# EAGLE design terminal (EAGLE 6.5.0)
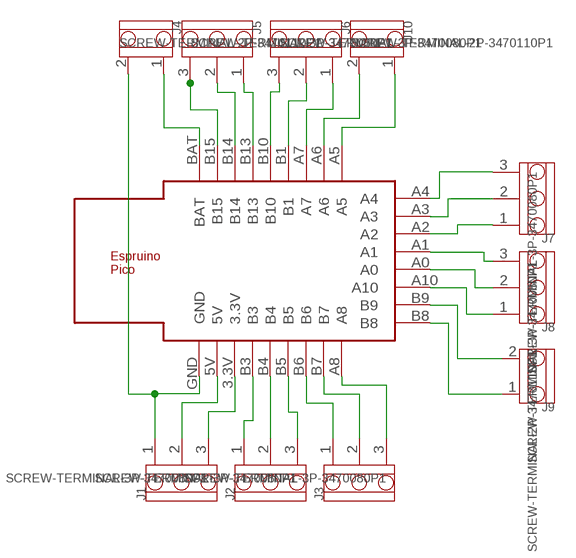
[diagram p0: schematic, sheet 1]

## Parts
J1  SCREW-TERMINAL-3P-3470080P1  [3P-5.0]
J2  SCREW-TERMINAL-3P-3470080P1  [3P-5.0]
J3  SCREW-TERMINAL-3P-3470080P1  [3P-5.0]
J4  SCREW-TERMINAL-2P-3470110P1  [2P-5.0]
J5  SCREW-TERMINAL-3P-3470080P1  [3P-5.0]
J6  SCREW-TERMINAL-3P-3470080P1  [3P-5.0]
J7  SCREW-TERMINAL-3P-3470080P1  [3P-5.0]
J8  SCREW-TERMINAL-3P-3470080P1  [3P-5.0]
J9  SCREW-TERMINAL-2P-3470110P1  [2P-5.0]
J10  SCREW-TERMINAL-2P-3470110P1  [2P-5.0]
U$1  ESPRUINO_PICO_SMD  [ESPRUINO_PICO_SMD]

## Nets
N$1: J4.1 U$1.BAT
N$2: J5.3 U$1.B15
N$3: J5.2 U$1.B14
N$4: J5.1 U$1.B13
N$5: J6.3 U$1.B10
N$6: J6.2 U$1.B1
N$7: J6.1 U$1.A7
N$8: J10.2 U$1.A6
N$9: J10.1 U$1.A5
N$10: J7.3 U$1.A4
N$11: J7.2 U$1.A3
N$12: J7.1 U$1.A2
N$13: J8.3 U$1.A1
N$14: J8.2 U$1.A0
N$15: J8.1 U$1.A10
N$16: J9.2 U$1.B9
N$17: J9.1 U$1.B8
N$18: J3.3 U$1.A8
N$19: J3.2 U$1.B7
N$20: J3.1 U$1.B6
N$21: J2.3 U$1.B5
N$22: J2.2 U$1.B4
N$23: J2.1 U$1.B3
N$24: J1.3 U$1.3.3V
N$25: J1.2 U$1.5V
N$26: J1.1 J4.2 U$1.GND

## Library data of the parts
J1-J3 J5-J8 = OPL Eagle Library:SCREW-TERMINAL-3P
J4 J9 J10 = OPL Eagle Library:SCREW-TERMINAL-2P
U$1 = espruino_pico:ESPRUINO_PICO_SMD

## Net classes
0 default: width 0.305 mm

## Board
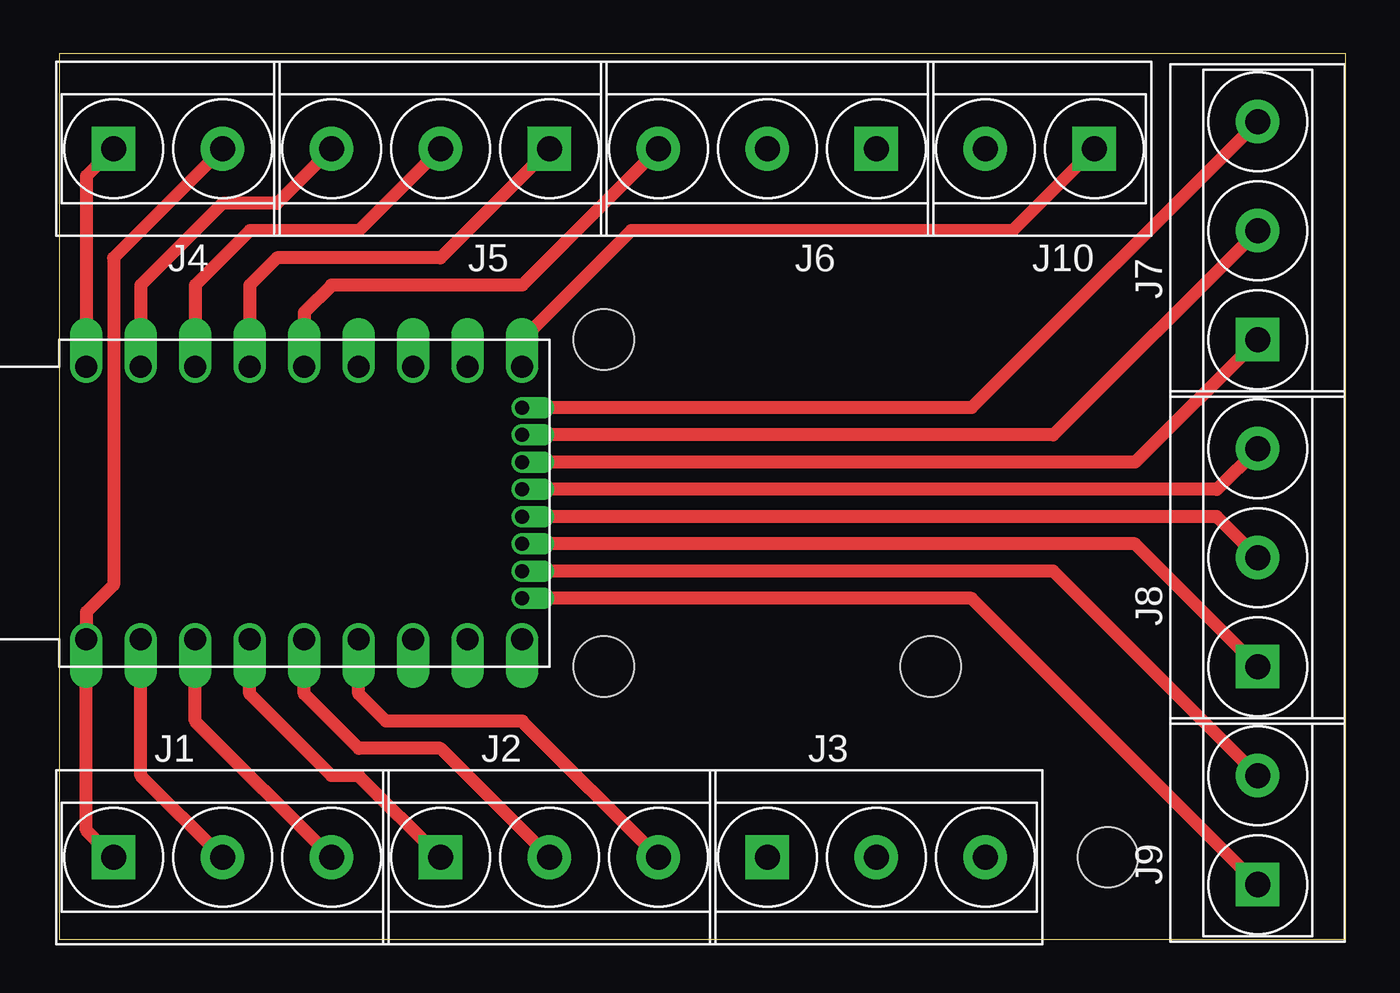
[diagram p1: board, top side]
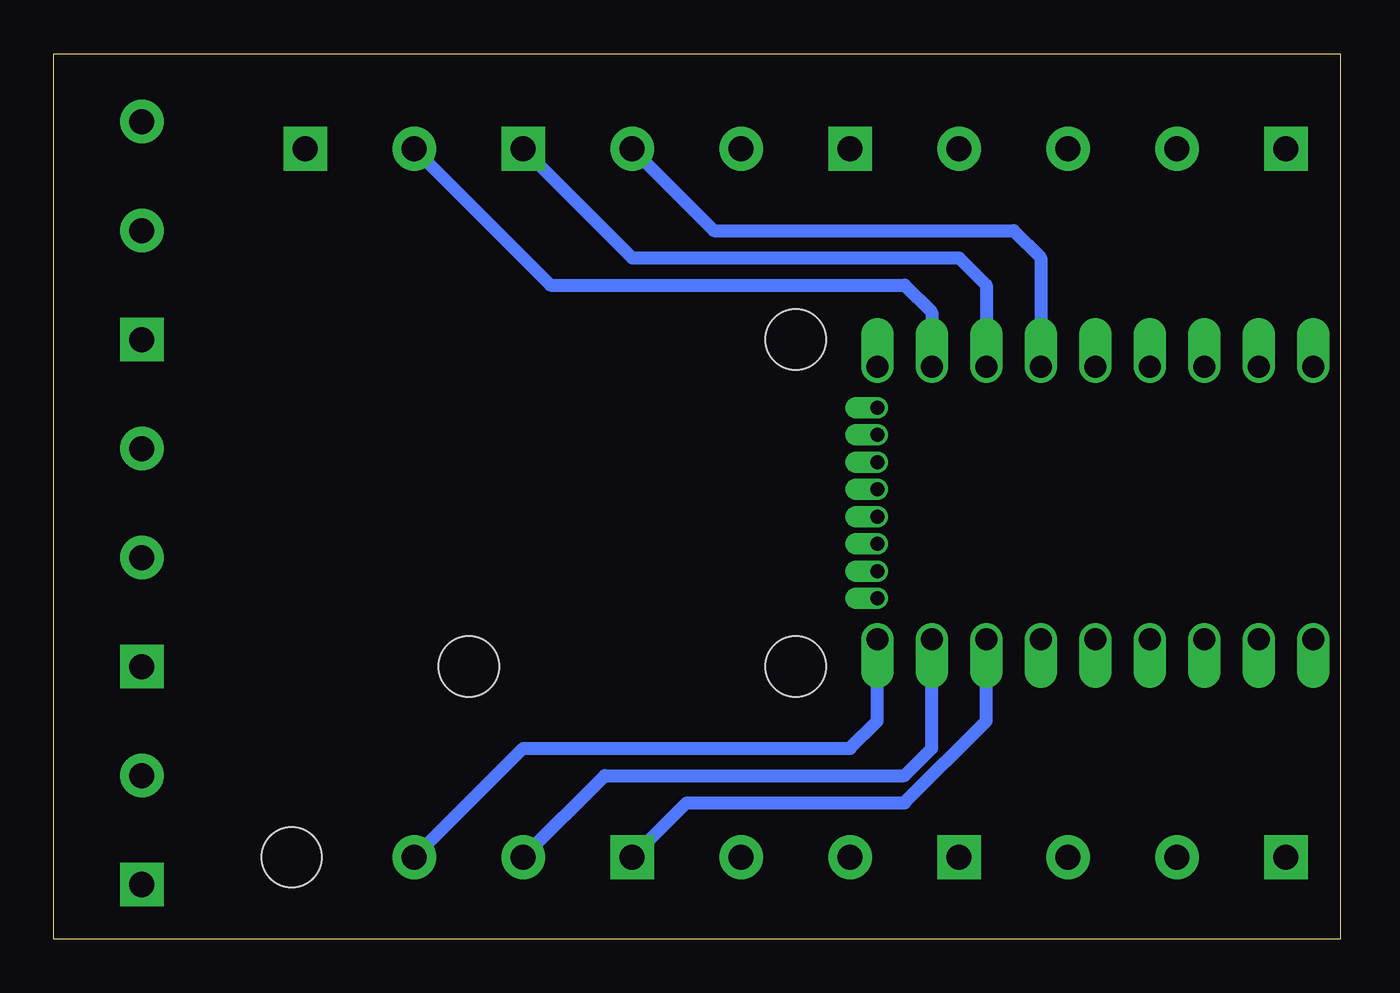
[diagram p2: board, bottom side, seen from below]

Size 59.99 x 41.27 mm. Coordinates in mm from the lower left corner, seen from the top.
Outline: 0,0 59.99,0 59.99,41.27 0,41.27 0,0
Copper layers (1*16): Top 0.0356mm / dielectric 1.5011mm / Bottom 0.0356mm
Design rules "oshpark": minimum track width 10mil, minimum drill 13mil, track to track 8mil, track to pad 6mil, pad to pad 6mil, via to via 6mil, smd to smd 6mil, copper to edge 15mil, drill to drill 6mil, minimum pad ring 7mil, minimum via ring 7mil, stop-mask expansion 4mil, vias tented up to drill 15mil, thermal gap 10mil
Holes 2.8 mm at 48.9,3.81 40.64,12.7 25.4,27.94 25.4,12.7

### Footprints (pad centres in the part's own frame; a part is rotated, then mirrored left to right if it is on the bottom)
3P-5.0 = drill 1.168 pad 2.032 square: 1 -5.08,0 | drill 1.168 pad 2.032: 2 0,0; 3 5.08,0
2P-5.0 = drill 1.168 pad 2.032 square: 1 -2.54,0 | drill 1.168 pad 2.032: 2 2.54,0
ESPRUINO_PICO_SMD = drill 1.016 offset: 3.3V -8.89,-6.35; 5V -11.43,-6.35; A5 6.35,6.35; A6 3.81,6.35; A7 1.27,6.35; A8 6.35,-6.35; B1 -1.27,6.35; B3 -6.35,-6.35; B4 -3.81,-6.35; B5 -1.27,-6.35; B6 1.27,-6.35; B7 3.81,-6.35; B10 -3.81,6.35; B13 -6.35,6.35; B14 -8.89,6.35; B15 -11.43,6.35; BAT -13.97,6.35; GND -13.97,-6.35 | drill 0.65 pad 0.965 offset: A0 6.35,-0.635; A1 6.35,0.635; A2 6.35,1.905; A3 6.35,3.175; A4 6.35,4.445; A10 6.35,-1.905; B8 6.35,-4.445; B9 6.35,-3.175

### Placement (x,y rotation side)
J1  7.62,3.81 0 top
J2  22.86,3.81 0 top
J3  38.1,3.81 0 top
J4  5.08,36.83 0 top
J5  17.78,36.83 180 top
J6  33.02,36.83 180 top
J7  55.88,33.02 90 top
J8  55.88,17.78 90 top
J9  55.88,5.08 90 top
J10  45.72,36.83 180 top
U$1  15.24,20.32 0 top

### Tracks (layer width: path | path; a pad name or v marks a point on that pad's centre or on a via)
N$1
  Top 0.61: J4.1 1.27,35.56 U$1.BAT
N$2
  Top 0.61: J5.3 10.16,34.29 7.62,34.29 3.81,30.48 U$1.B15
N$3
  Top 0.61: J5.2 13.97,33.02 8.89,33.02 6.35,30.48 U$1.B14
N$4
  Top 0.61: J5.1 17.78,31.75 10.16,31.75 8.89,30.48 U$1.B13
N$5
  Top 0.61: J6.3 21.59,30.48 12.7,30.48 11.43,29.21 U$1.B10
N$6
  Bottom 0.61: J6.2 29.21,33.02 15.24,33.02 13.97,31.75 U$1.B1
N$7
  Bottom 0.61: J6.1 33.02,31.75 17.78,31.75 16.51,30.48 U$1.A7
N$8
  Bottom 0.61: J10.2 36.83,30.48 20.32,30.48 19.05,29.21 U$1.A6
N$9
  Top 0.61: J10.1 44.45,33.02 26.67,33.02 21.59,27.94 U$1.A5
N$10
  Top 0.61: J7.3 42.55,24.77 U$1.A4
N$11
  Top 0.61: J7.2 46.35,23.5 U$1.A3
N$12
  Top 0.61: J7.1 50.16,22.23 U$1.A2
N$13
  Top 0.61: J8.3 53.98,20.95 U$1.A1
N$14
  Top 0.61: J8.2 53.98,19.68 U$1.A0
N$15
  Top 0.61: J8.1 50.16,18.41 U$1.A10
N$16
  Top 0.61: J9.2 46.35,17.14 U$1.B9
N$17
  Top 0.61: J9.1 42.55,15.88 U$1.B8
N$18
  Bottom 0.61: J3.3 38.1,8.89 22.86,8.89 21.59,10.16 U$1.A8
N$19
  Bottom 0.61: J3.2 34.29,7.62 20.32,7.62 19.05,8.89 U$1.B7
N$20
  Bottom 0.61: J3.1 30.48,6.35 20.32,6.35 16.51,10.16 U$1.B6
N$21
  Top 0.61: J2.3 21.59,10.16 15.24,10.16 13.97,11.43 U$1.B5
N$22
  Top 0.61: J2.2 17.78,8.89 13.97,8.89 11.43,11.43 U$1.B4
N$23
  Top 0.61: J2.1 13.97,7.62 12.7,7.62 8.89,11.43 U$1.B3
N$24
  Top 0.61: J1.3 6.35,10.16 U$1.3.3V
N$25
  Top 0.61: J1.2 3.81,7.62 U$1.5V
N$26
  Top 0.61: J4.2 2.54,31.75 2.54,16.51 1.27,15.24 U$1.GND 1.27,5.08 J1.1